# Altium schematic sheet 19.SchDoc
size 513 x 386 mm
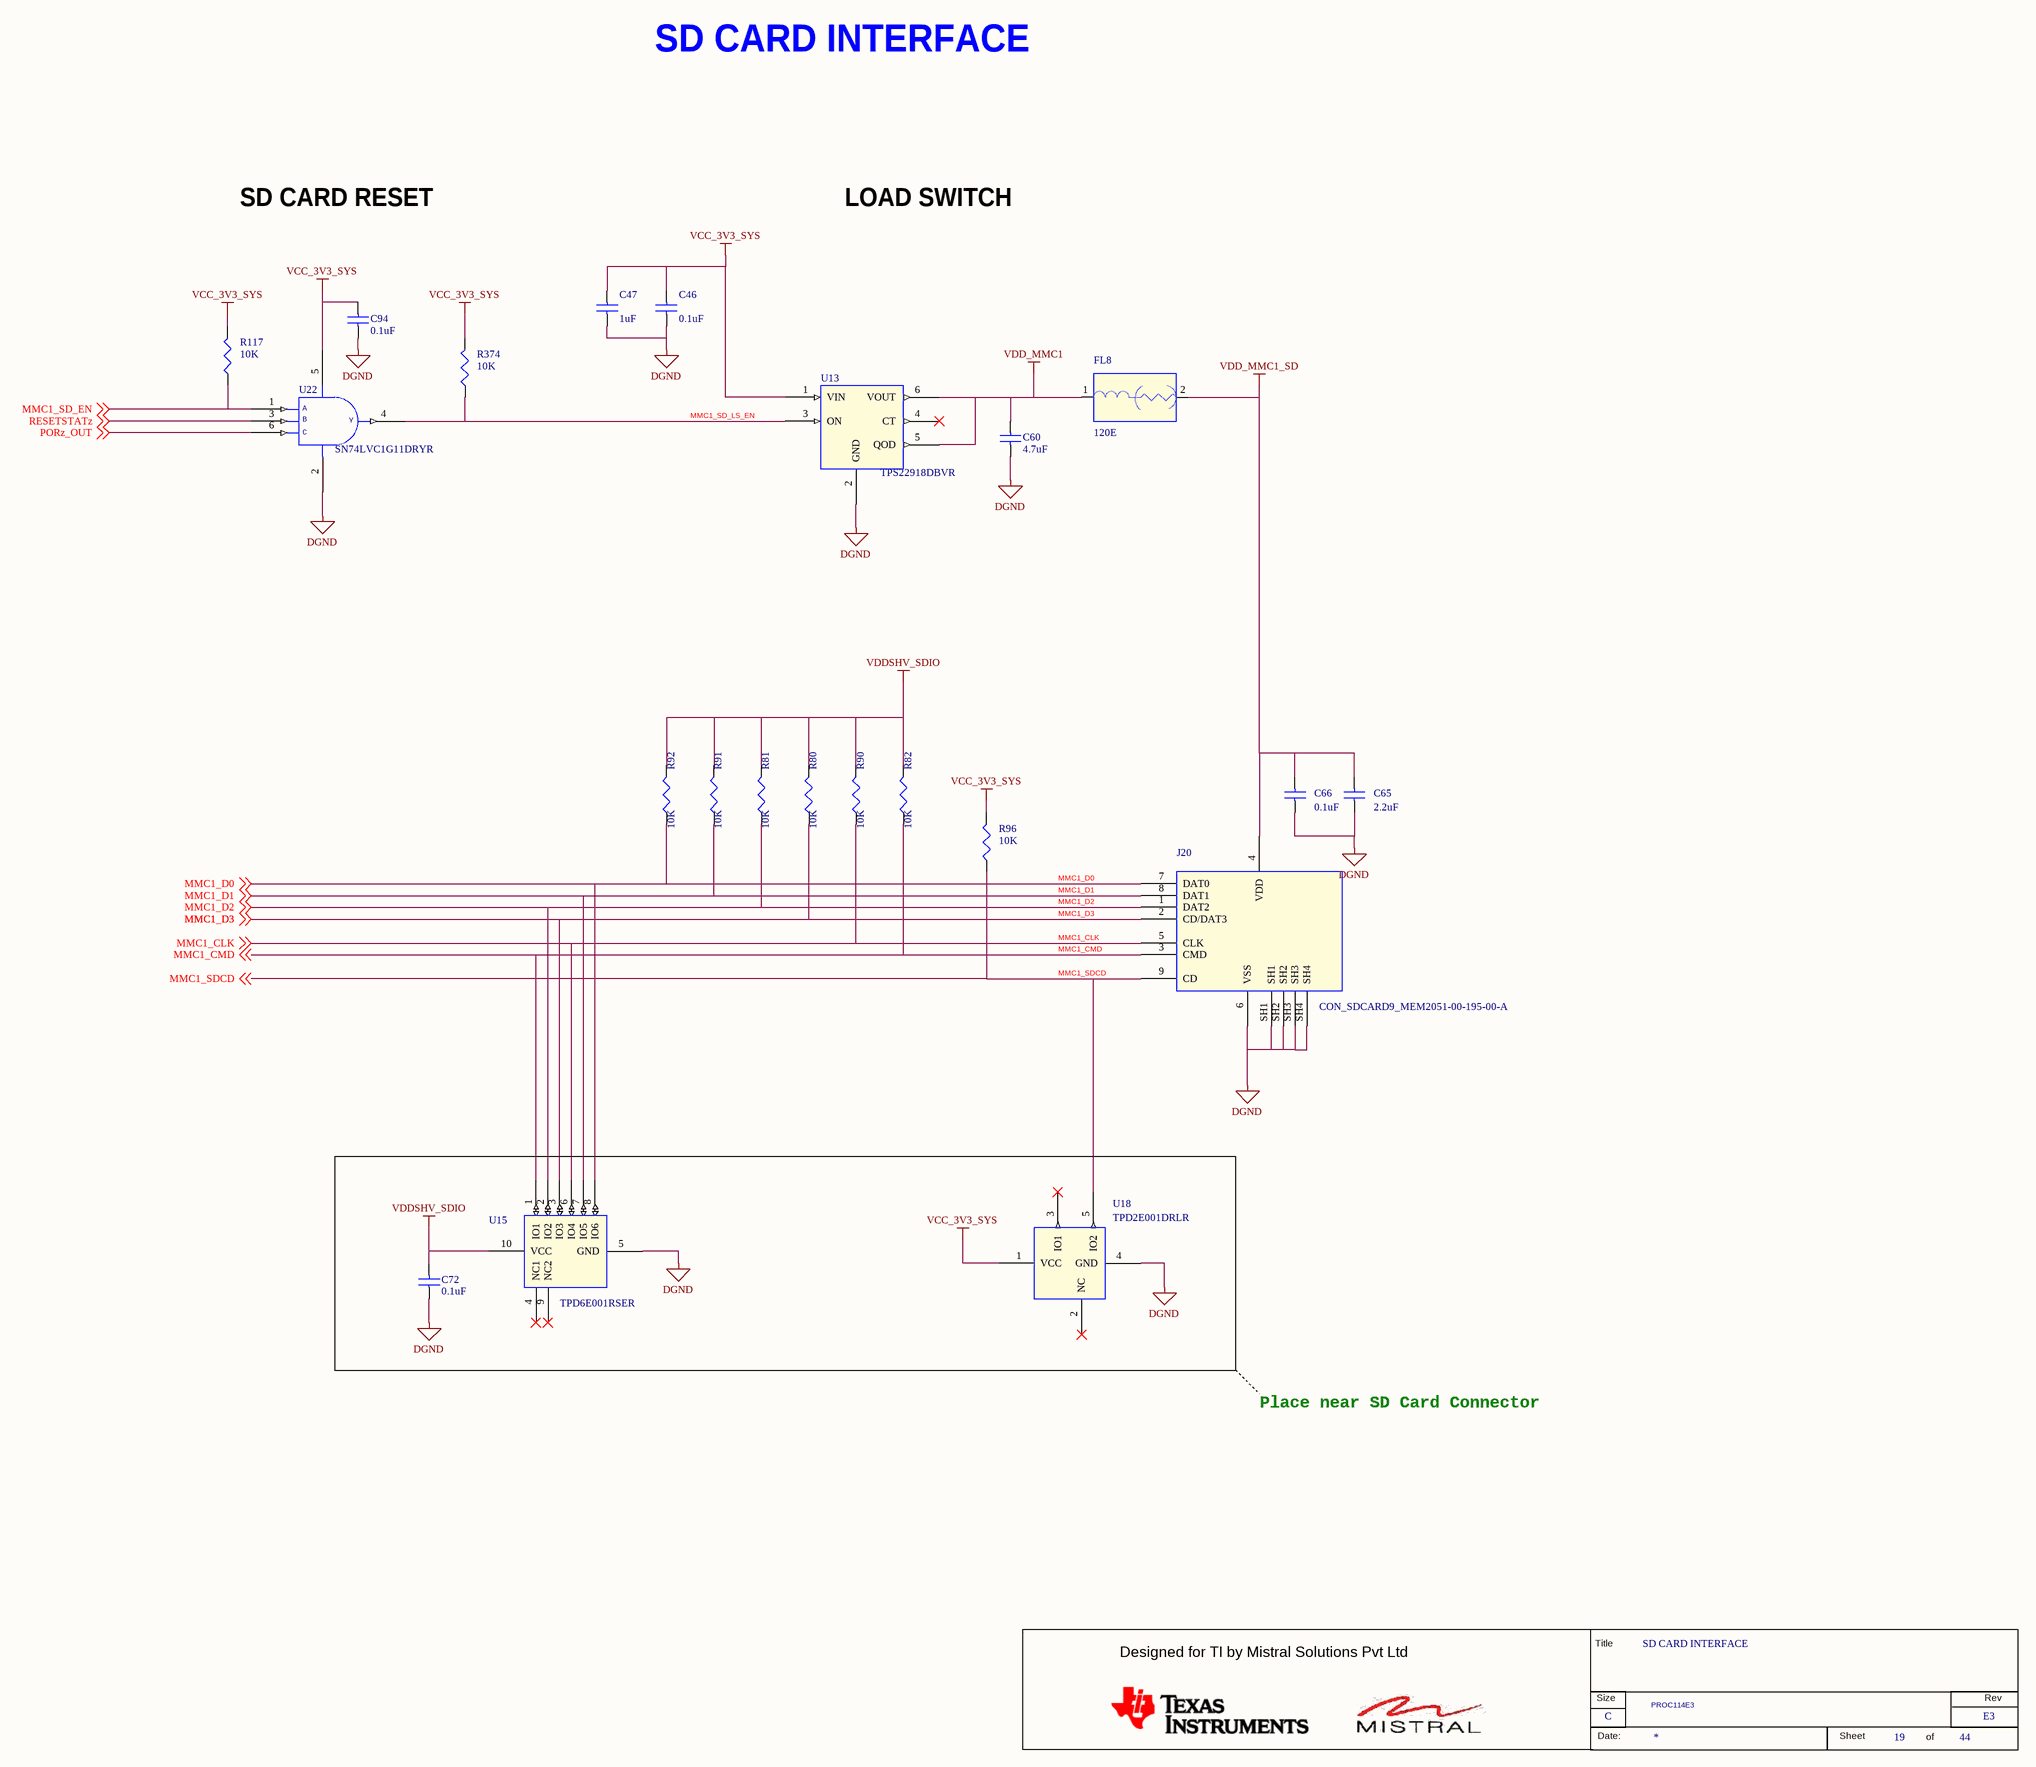
[diagram p0: 19.SchDoc]

## Parts
*  RevCode: E3  Title: SD CARD INTERFACE  Page Size: C  Page Number: 19  Page Count: 44  Variant Name: PROC114E3  (hidden comment: MISTRAL_TITLEBLK_CSIZE)  (graphical)
C46  0.1uF  [CAP0402_0-75]
C47  1uF  [CAP0201_0-5]
C60  4.7uF  [CAP0402_0-75]
C65  2.2uF  [CAP0402_0-75]
C66  0.1uF  [CAP0402_0-75]
C72  0.1uF  [CAP0402_0-75]
C94  0.1uF  [CAP0402_0-75]
FL8  120E  [EMIFIL_BLM15A_0402_0-6]
J20  CON_SDCARD9_MEM2051-00-195-00-A  [CON_SD9_MEM2051-00-195-00_S_R_S_2-1]
R80  10K  [RES0201_0-5]
R81  10K  [RES0201_0-5]
R82  10K  [RES0201_0-5]
R90  10K  [RES0201_0-5]
R91  10K  [RES0201_0-5]
R92  10K  [RES0201_0-5]
R96  10K  [RES0201_0-5]
R117  10K  [RES0201_0-5]
R374  10K  [RES0201_0-5]
U13  TPS22918DBVR  [SOT23-6]
U15  TPD6E001RSER  [UQFN10_19-68_80X60_0-6]
U18  TPD2E001DRLR  [SOT553-5_0-6]
U22  SN74LVC1G11DRYR  [SON6_SN74LVC2G17_40X60_0-6]

## Nets
DGND: C46.2 C47.2 C60.2 C65.1 C66.1 C72.1 C94.2 J20.6(VSS) J20.SH1 J20.SH2 J20.SH3 J20.SH4 U13.2(GND) U15.5(GND) U18.4(GND) U22.2(GND)
VCC_3V3_SYS: C46.1 C47.1 C94.1 R96.2 R117.2 R374.2 U13.1(VIN) U18.1(VCC) U22.5(VCC)
VDD_MMC1: C60.1 FL8.1 U13.5(QOD) U13.6(VOUT)
VDD_MMC1_SD: C65.2 C66.2 FL8.2 J20.4(VDD)
VDDSHV_SDIO: C72.2 R80.2 R81.2 R82.2 R90.2 R91.2 R92.2 U15.10(VCC)
MMC1_CLK: J20.5(CLK) R90.1 U15.6(IO4) ; off-sheet MMC1_CLK
MMC1_CMD: J20.3(CMD) R82.1 U15.1(IO1) ; off-sheet MMC1_CMD
MMC1_D0: J20.7(DAT0) R92.1 U15.8(IO6) ; off-sheet MMC1_D0
MMC1_D1: J20.8(DAT1) R91.1 U15.7(IO5) ; off-sheet MMC1_D1
MMC1_D2: J20.1(DAT2) R81.1 U15.2(IO2) ; off-sheet MMC1_D2
MMC1_D3: J20.2(CD/DAT3) R80.1 U15.3(IO3) ; off-sheet MMC1_D3
MMC1_SD_EN: R117.1 U22.1(A) ; off-sheet MMC1_SD_EN
MMC1_SD_LS_EN: R374.1 U13.3(ON) U22.4(Y)
MMC1_SDCD: J20.9(CD) R96.1 U18.5(IO2) ; off-sheet MMC1_SDCD
PORz_OUT: U22.6(C) ; off-sheet PORz_OUT
RESETSTATz: U22.3(B) ; off-sheet RESETSTATz

Not connected (* = marked no-connect by the designer): U13 4(CT)*; U15 4(NC1)* 9(NC2)*; U18 2(NC)* 3(IO1)*

## Notes on the sheet
- SD CARD INTERFACE
- SD CARD RESET
- LOAD SWITCH
- Place near SD Card Connector
- (in symbol MISTRAL_TITLEBLK_CSIZE) Title; Designed for TI by Mistral Solutions Pvt Ltd; Size; Rev; Date:; Sheet; of

## Library data of the parts
* = MISTRAL_TITLEBLK_CSIZE: Issue: 1.0; Page Create Date: March  8, 1995; Page Modify Date: *; Schematic Page Count: 44; Schematic Page Number: 19
C46 C66 C94 = CAP_Dup2: CAP CERAMIC 0.1uF 50V 10% X7R 0402; Alt_Mfr_part_number: CC0402KRX5R8BB104; Mistral Part No: 120011100014-R; Mfr_name: MURATA; Mfr_part_number: GRM155R71H104KE14D; Part_type: CAPACITORS\CERAMIC; Alt_Mfr_name: YAGEO AMERICA; Project: J7_CP; Wattage: NA; Customs_HS_Code: 85322990; Custom_Duty: 15%; Tolerance: 10%; Voltage: 50V; Package: 0402; Distributor_name: DIGIKEY; Distributor_part_number: 490-10700-1-ND; Height: 0.55MM; Weight: 3.1mg; Temperature: -55°C+125°C; Datasheet: Y:\MIS_DATABASE\DATASHEETS\CAPACITORS\GRM155R71H104KE14.PDF; Crtd /date: ALVY/211020; Chkd/date: MANIRAJA/261020; MECHANICAL 3D STEP FILE: CAP0402_0-75; Library Ref: CAP; Footprint Ref: CAP0402_0-75; Library Path: Y:\MIS_DATABASE\Library\ALTIUM_TOOL\SCHEMATICS_PARTS\MS_DISCRETE_Library.schlib; Footprint Path: Y:\MIS_DATABASE\Library\ALTIUM_TOOL\PCB_FOOTPRINTS\Altium_Footprint_Lib.PcbLib; PCB Footprint: CAP0402_0-75
C47 = CAP_Dup2: CAP CERAMIC 1uF 16V 20% X5R 0201; Part_type: CAPACITORS\CERAMIC; Mfr_part_number: GRM033R61C105ME15D; Mfr_name: MURATA; Mistral Part No: 120018090038-R; Custom_Duty: 15%; Customs_HS_Code: 85322990; Wattage: NA; Project: QCS610_NANOSOM; Footprint Ref: CAP0201_0-5; Library Ref: CAP; Footprint Path: Y:\MIS_DATABASE\Library\ALTIUM_TOOL\PCB_FOOTPRINTS\Altium_Footprint_Lib.PcbLib; Library Path: Y:\MIS_DATABASE\Library\ALTIUM_TOOL\SCHEMATICS_PARTS\MS_DISCRETE_Library.schlib; MECHANICAL 3D STEP FILE: CAP0201_0-5; Chkd/date: MANIRAJA/300520; Crtd /date: ALVY/260520; Datasheet: Y:\MIS_DATABASE\DATASHEETS\CAPACITORS\GRM033R61C105ME15.PDF; Temperature: -55°C+85°C; Weight: 0.33mg; Height: 0.39MM; Distributor_part_number: 490-18654-1-ND; Distributor_name: DIGIKEY; Package: 0201; Voltage: 16V; Tolerance: 20%; PCB Footprint: CAP0201_0-5
C60 = CAP_Dup2: CAP CERAMIC 4.7uF 10V 20% X5R 0402; Mistral Part No: 120012060002-R; Mfr_name: MURATA; Mfr_part_number: GRM155R61A475MEAAD; Part_type: CAPACITORS\CERAMIC; Project: TI_J7SVB_PCIE_ADD-ON-CARD; Wattage: NA; Customs_HS_Code: 85322990; Custom_Duty: 15%; Tolerance: 20%; Voltage: 10V; Package: 0402; Distributor_name: DIGIKEY; Distributor_part_number: 490-14306-1-ND; Height: 0.65MM; Weight: 14mg; Temperature: -55°C+85°C; Datasheet: Y:\MIS_DATABASE\DATASHEETS\CAPACITORS\GRM155R61A475MEAAD.PDF; Crtd /date: ALVY/110718; Chkd/date: MANIRAJA/110718; MECHANICAL 3D STEP FILE: CAP0402_0-75; Library Ref: CAP; Footprint Ref: CAP0402_0-75; Library Path: Y:\MIS_DATABASE\Library\ALTIUM_TOOL\SCHEMATICS_PARTS\MS_DISCRETE_Library.schlib; Footprint Path: Y:\MIS_DATABASE\Library\ALTIUM_TOOL\PCB_FOOTPRINTS\Altium_Footprint_Lib.PcbLib; PCB Footprint: CAP0402_0-75
C65 = CAP_Dup2: CAP CERAMIC 2.2uF 25V 10% X5R 0402; Part_type: CAPACITORS\CERAMIC; Mfr_part_number: GRM155R61E225KE11D; Mfr_name: MURATA; Mistral Part No: 120015120001-R; Custom_Duty: 15%; Customs_HS_Code: 85322990; Wattage: NA; Project: TI_AM263X_CC; MECHANICAL 3D STEP FILE: CAP0402_0-75; Chkd/date: ALVY/010721; Crtd /date: MANIRAJA/010721; Datasheet: Y:\MIS_DATABASE\DATASHEETS\CAPACITORS\GRM155R61E225KE11.PDF; Temperature: -55°C+85°C; Weight: 1.5mg; Height: 0.70MM; Library Ref: CAP; Distributor_part_number: 490-12703-1-ND; Distributor_name: DIGIKEY; Package: 0402; Voltage: 25V; Tolerance: 10%; Footprint Ref: CAP0402_0-75; Library Path: Y:\MIS_DATABASE\Library\ALTIUM_TOOL\SCHEMATICS_PARTS\MS_DISCRETE_Library.schlib; Footprint Path: Y:\MIS_DATABASE\Library\ALTIUM_TOOL\PCB_FOOTPRINTS\Altium_Footprint_Lib.PcbLib; PCB Footprint: CAP0402_0-75
C72 = CAP_Dup2: CAP CERAMIC 0.1uF 50V 10% X7R 0402; Alt_Mfr_name: YAGEO AMERICA; Part_type: CAPACITORS\CERAMIC; Mfr_part_number: GRM155R71H104KE14D; Mfr_name: MURATA; Mistral Part No: 120011100014-R; Alt_Mfr_part_number: CC0402KRX5R8BB104; Custom_Duty: 15%; Customs_HS_Code: 85322990; Wattage: NA; Project: J7_CP; Footprint Path: Y:\MIS_DATABASE\Library\ALTIUM_TOOL\PCB_FOOTPRINTS\Altium_Footprint_Lib.PcbLib; Library Path: Y:\MIS_DATABASE\Library\ALTIUM_TOOL\SCHEMATICS_PARTS\MS_DISCRETE_Library.schlib; Footprint Ref: CAP0402_0-75; Library Ref: CAP; MECHANICAL 3D STEP FILE: CAP0402_0-75; Chkd/date: MANIRAJA/261020; Crtd /date: ALVY/211020; Datasheet: Y:\MIS_DATABASE\DATASHEETS\CAPACITORS\GRM155R71H104KE14.PDF; Temperature: -55°C+125°C; Weight: 3.1mg; Height: 0.55MM; Distributor_part_number: 490-10700-1-ND; Distributor_name: DIGIKEY; Package: 0402; Voltage: 50V; Tolerance: 10%; PCB Footprint: CAP0402_0-75
FL8 = EMIFILTER_IND: IND FERRITE BEAD CHIP 120E 2A 0402; Part_type: INDUCTOR; Mfr_part_number: BLM15PX121SN1D; Mfr_name: MURATA; Mistral Part No: 130013060022-R; Custom_Duty: 24%; Customs_HS_Code: 85369090; Wattage: NA; Tolerance: 25%; Project: GEN_3-8; Footprint Path: Y:\MIS_DATABASE\Library\ALTIUM_TOOL\PCB_FOOTPRINTS\Altium_Footprint_Lib.PcbLib; Library Path: Y:\MIS_DATABASE\Library\ALTIUM_TOOL\SCHEMATICS_PARTS\MS_FILTER_Library.schlib; MECHANICAL 3D STEP FILE: EMIFIL_BLM15A_0402_0-6; Chkd/date: NAVEED/241114; Crtd /date: USMAN/170613; Datasheet: Y:\MIS_DATABASE\DATASHEETS\DISCRETES\INDUCTORS\BLM15-SN1-SER.PDF; Temperature: -55°C+125°C; Weight: 1mg; Height: 0.55MM; Library Ref: EMIFILTER_IND; Distributor_part_number: 490-9656-1-ND; Distributor_name: DIGIKEY; Package: 0402; Voltage: NA; Footprint Ref: EMIFIL_BLM15A_0402_0-6; PCB Footprint: EMIFIL_BLM15A_0402_0-6
J20 = CON_SDCARD9_MEM2075-00-140: CON MICROSD CARD 9POS FEMALE RT SMD; Mistral Part No: 150021090028-R; Mfr_name: GCT; Part_type: CONNECTOR\MEMORY CARD; Project: TI_AM62x SKEVM_BRD; Tolerance: NA; Customs_HS_Code: 85369090; Custom_Duty: 24%; Footprint Ref: CON_SD9_MEM2051-00-195-00_S_R_S_2-1; Mfr_part_number: MEM2051-00-195-00-A; Voltage: NA; Wattage: NA; Package: SMD; Distributor_name: DIGIKEY; Distributor_part_number: 2073-MEM2051-00-195-00-ACT-ND; Library Ref: CON_SDCARD9_MEM2075-00-140; Height: 2.05MM; Weight: 1000mg; Temperature: -40°C+85°C; Datasheet: Y:\MIS_DATABASE\DATASHEETS\CONNECTORS\MEM2051-00-195-00-A.PDF; Crtd /date: ALVY/240921; Chkd/date: MANIRAJA/270921; MECHANICAL 3D STEP FILE: CON_SD9_MEM2051-00-195-00_S_R_S_2-1; Library Path: Y:\MIS_DATABASE\Library\ALTIUM_TOOL\SCHEMATICS_PARTS\MS_CONNECTOR_Library.schlib; Footprint Path: Y:\MIS_DATABASE\Library\ALTIUM_TOOL\PCB_FOOTPRINTS\Altium_Footprint_Lib.PcbLib; PCB Footprint: CON_SD9_MEM2051-00-195-00_S_R_S_2-1
R80-R82 R90-R92 R96 = RESISTOR_Dup6: RES 10K 1/20W 5% 0201; Part_type: RESISTORS\FIXED; Mfr_part_number: RC0201JR-0710KL; Mfr_name: YAGEO AMERICA; Mistral Part No: 110010070051-R; Custom_Duty: 15%; Customs_HS_Code: 85332119; Voltage: NA; Project: GOLDEN-I LITE; MECHANICAL 3D STEP FILE: RES0201_0-5; Chkd/date: MANIRAJA/050517; Crtd /date: MANIRAJA/050517; Datasheet: Y:\MIS_DATABASE\DATASHEETS\RESISTORS\RCXXXXL-SER_MAR18.PDF; Temperature: -55°C+125°C; Weight: 0.17mg; Height: 0.26MM; Distributor_part_number: 311-10KNCT-ND; Distributor_name: DIGIKEY; Package: 0201; Wattage: 1/20W; Tolerance: 5%; Library Ref: RESISTOR; Footprint Ref: RES0201_0-5; Library Path: Y:\MIS_DATABASE\Library\ALTIUM_TOOL\SCHEMATICS_PARTS\MS_DISCRETE_Library.schlib; Footprint Path: Y:\MIS_DATABASE\Library\ALTIUM_TOOL\PCB_FOOTPRINTS\Altium_Footprint_Lib.PcbLib; PCB Footprint: RES0201_0-5
R117 R374 = RESISTOR_Dup6: RES 10K 1/20W 5% 0201; Mistral Part No: 110010070051-R; Mfr_name: YAGEO AMERICA; Mfr_part_number: RC0201JR-0710KL; Part_type: RESISTORS\FIXED; Project: GOLDEN-I LITE; Voltage: NA; Customs_HS_Code: 85332119; Custom_Duty: 15%; Footprint Path: Y:\MIS_DATABASE\Library\ALTIUM_TOOL\PCB_FOOTPRINTS\Altium_Footprint_Lib.PcbLib; Library Path: Y:\MIS_DATABASE\Library\ALTIUM_TOOL\SCHEMATICS_PARTS\MS_DISCRETE_Library.schlib; Footprint Ref: RES0201_0-5; Library Ref: RESISTOR; Tolerance: 5%; Wattage: 1/20W; Package: 0201; Distributor_name: DIGIKEY; Distributor_part_number: 311-10KNCT-ND; Height: 0.26MM; Weight: 0.17mg; Temperature: -55°C+125°C; Datasheet: Y:\MIS_DATABASE\DATASHEETS\RESISTORS\RCXXXXL-SER_MAR18.PDF; Crtd /date: MANIRAJA/050517; Chkd/date: MANIRAJA/050517; MECHANICAL 3D STEP FILE: RES0201_0-5; PCB Footprint: RES0201_0-5
U13 = TPS22918DBVR_SOT23-6: IC ON RESISTANCE LOAD SWITCH SOT23-6; Part_type: ICS\POWER; Mfr_name: TEXAS INSTRUMENTS; Mistral Part No: 142016050007-R; Automotive Alternate_mfr_part_number: TPS22918TDBVRQ1; Custom_Duty: 15%; Customs_HS_Code: 85423100; Wattage: NA; Project: TMDXCSK8127; Chkd/date: VASANTHA/130516; Crtd /date: VASANTHA/130516; Datasheet: Y:\MIS_DATABASE\DATASHEETS\ICS\POWER\TPS22918DBV.PDF; Temperature: -40°C to 105°C; Weight: NA; Height: 1.45MM; Library Ref: TPS22918DBVR_SOT23-6; Distributor_part_number: TPS22918DBVR-ND; Distributor_name: DIGIKEY; Package: SOT23-6; Voltage: NA; Tolerance: NA; Mfr_part_number: TPS22918DBVR; Automotive Alternate_mfr_name: TEXAS INSTRUMENTS; PCB Footprint: SOT23-6
U15 = TPD6E001RSE_UQFN10: IC 6CH ESD-PROTECTION ARRAY UQFN10; Part_type: ICS\INTERFACE; Mfr_name: TEXAS INSTRUMENTS; Mistral Part No: 141011080020-R; IBISSP_MODLES: Y:\MIS_DATABASE\IBIS\ICs\INTERFACE\TPD6E001RSE.IBS; Custom_Duty: 15%; Customs_HS_Code: 85423100; Wattage: NA; Project: DM385EVM_BASE-BOARD; MECHANICAL 3D STEP FILE: UQFN10_19-68_80X60_0-6; Chkd/date: USMAN/070612; Crtd /date: BAVISH/160811; Datasheet: Y:\MIS_DATABASE\DATASHEETS\ICS\INTERFACE\TPD6E001.PDF; Temperature: -40°C+85°C; Weight: 7mg; Height: 0.60MM; Distributor_part_number: 296-21888-1-ND; Distributor_name: DIGIKEY; Package: UQFN10; Voltage: NA; Tolerance: NA; Mfr_part_number: TPD6E001RSER; Library Ref: TPD6E001RSE_UQFN10; Footprint Ref: UQFN10_19-68_80X60_0-6; Library Path: Y:\MIS_DATABASE\Library\ALTIUM_TOOL\SCHEMATICS_PARTS\MS_MISCINTERFACE_Library.schlib; Footprint Path: Y:\MIS_DATABASE\Library\ALTIUM_TOOL\PCB_FOOTPRINTS\Altium_Footprint_Lib.PcbLib; PCB Footprint: UQFN10_19-68_80X60_0-6
U18 = TPD2E001DRLR_SOT-5: IC ESD-PROTECTION DIODE ARRAYS SOT-5; Part_type: ICS\ANALOG\ACTIVE FILTER; Mfr_name: TEXAS INSTRUMENTS; Mistral Part No: 140110060007-R; Custom_Duty: 15%; Customs_HS_Code: 85423100; Wattage: NA; Project: CENTAURUS; Footprint Path: Y:\MIS_DATABASE\Library\ALTIUM_TOOL\PCB_FOOTPRINTS\Altium_Footprint_Lib.PcbLib; Library Path: Y:\MIS_DATABASE\Library\ALTIUM_TOOL\SCHEMATICS_PARTS\MS_FILTER_Library.schlib; MECHANICAL 3D STEP FILE: SOT553-5_0-6; Chkd/date: NAVEED/150714; Crtd /date: MUDDU/250510; Datasheet: Y:\MIS_DATABASE\DATASHEETS\ICS\MISC\TPD2E001DRLR.PDF; Temperature: -40°C+85°C; Weight: 2.8mg; Height: 0.60MM; Footprint Ref: SOT553-5_0-6; Library Ref: TPD2E001DRLR_SOT-5; Distributor_part_number: 296-21883-1-ND; Distributor_name: DIGIKEY; Package: SOT-5; Voltage: NA; Tolerance: NA; Mfr_part_number: TPD2E001DRLR; PCB Footprint: SOT553-5_0-6
U22 = SN74LVC1G11DCKR_SC70-6: IC SINGLE 3-INPUT POSITIVE-AND GATE SON6; Mistral Part No: 141021010013-R; Mfr_name: TEXAS INSTRUMENTS; Part_type: ICS\DIGITAL\GATES; Project: AM64X_SKEVM; Tolerance: NA; Customs_HS_Code: 85423100; Custom_Duty: 15%; Footprint Ref: SON6_SN74LVC2G17_40X60_0-6; Mfr_part_number: SN74LVC1G11DRYR; Voltage: NA; Wattage: NA; Package: SON6; Distributor_name: DIGIKEY; Distributor_part_number: 296-30120-1-ND; Library Ref: SN74LVC1G11DCKR_SC70-6; Height: 0.60MM; Weight: 33mg; Temperature: -40°C+125°C; Datasheet: Y:\MIS_DATABASE\DATASHEETS\ICS\DIGITAL\GATES\SN74LVC1G_NOV16.PDF; Crtd /date: ALVY/270121; Chkd/date: MANIRAJA/270121; MECHANICAL 3D STEP FILE: SON6_SN74LVC2G17_40X60_0-6; Library Path: Y:\MIS_DATABASE\Library\ALTIUM_TOOL\SCHEMATICS_PARTS\MS_GATE_Library.schlib; Footprint Path: Y:\MIS_DATABASE\Library\ALTIUM_TOOL\PCB_FOOTPRINTS\Altium_Footprint_Lib.PcbLib; PCB Footprint: SON6_SN74LVC2G17_40X60_0-6